# Altium project proto_main.PrjPcb
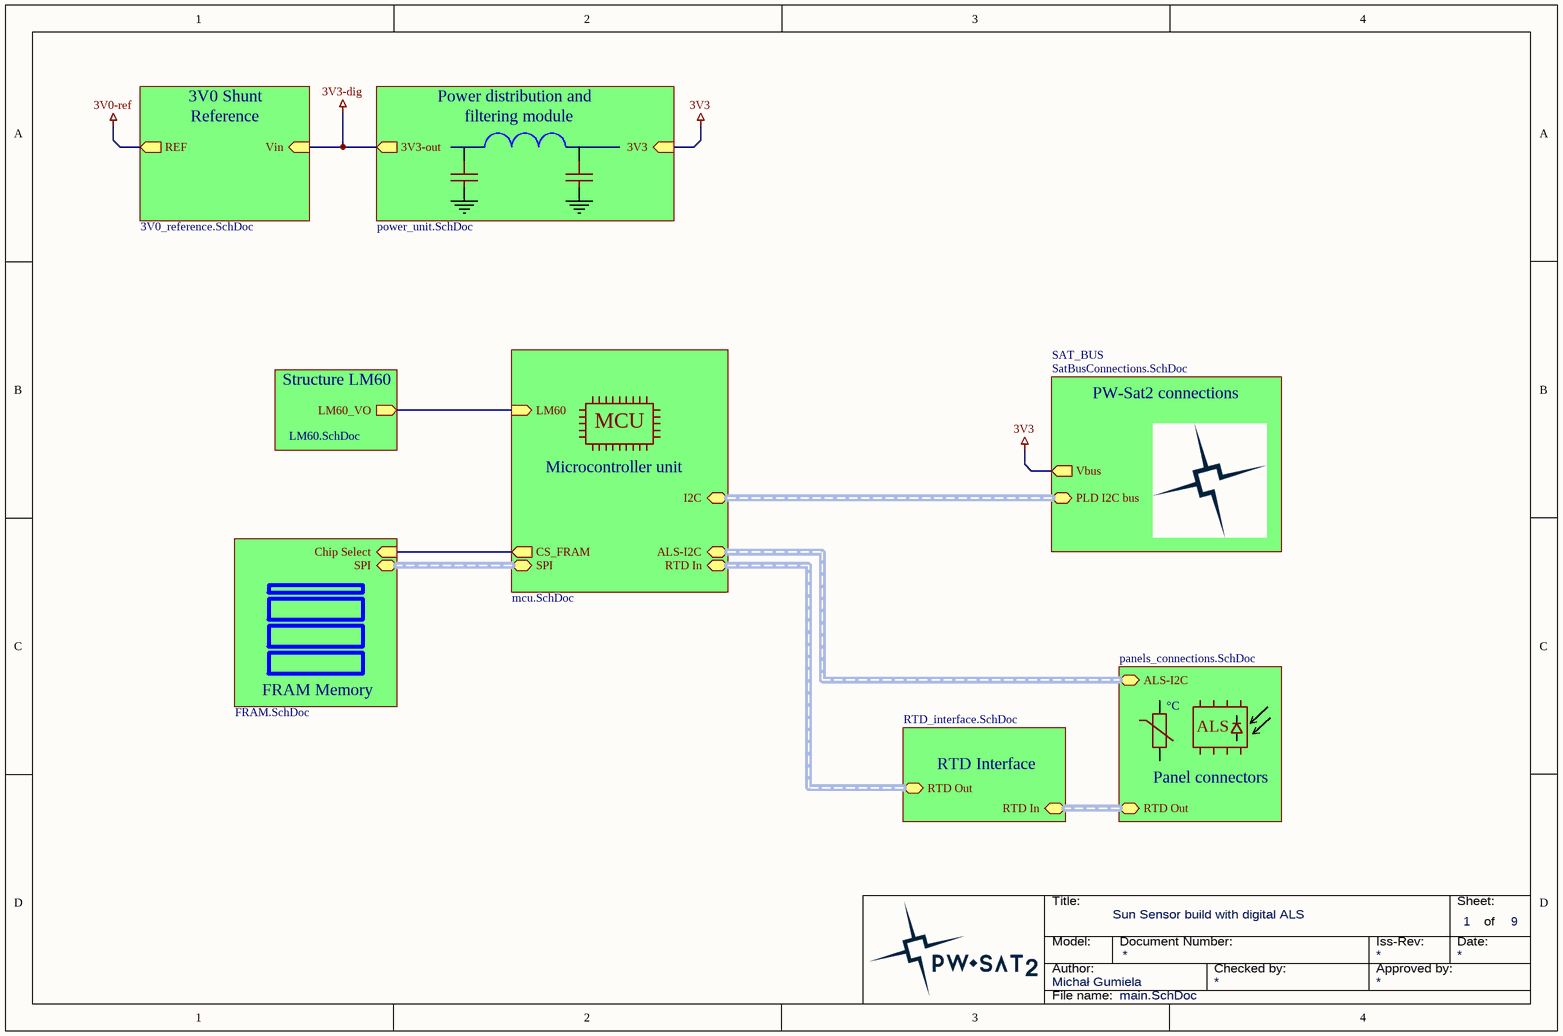
[diagram p0: main.SchDoc]
9 sheets, 83 parts. Net scope: hierarchical (ports join the sheet entries above them; power ports are global).
Board file: proto_main.PcbDoc
Sheets:
  main.SchDoc
    MCU = mcu.SchDoc
    POWER = power_unit.SchDoc
    FRAM = FRAM.SchDoc
    SAT_BUS = SatBusConnections.SchDoc
    PANELS_CONN = panels_connections.SchDoc
    RTD_Interface = RTD_interface.SchDoc
    3.0V Reference = 3V0_reference.SchDoc
    Structure LM60 = LM60.SchDoc

## Sheet main.SchDoc: Sun Sensor build with digital ALS
size A4; Author: Michał Gumiela; SheetNumber: 1; SheetTotal: 9; PageSetup: Record=PageOptions|CenterHorizontal=True|CenterVertical=True|PrintScale=1.00|XCorrection=1.00|YCorrection=1.00|PrintKind=0|BorderSize=5000000|LeftOffset=0|BottomOffset=0|Orientation=2|PaperLength=1000|PaperWidth=1000|Scale=100|PaperSource=7|PrintQuality=-3|MediaType=1|DitherType=10|PrintScaleMode=1|PaperKind=A4|PaperIndex=9

### Sub-sheets
3.0V Reference = 3V0_reference.SchDoc: Vin (in), REF (out)
FRAM = FRAM.SchDoc: SPI (harness SPI), Chip Select (in)
MCU = mcu.SchDoc: RTD In (harness RTD-DIV), ALS-I2C (harness SOFT-I2C), CS_FRAM (out), SPI (harness SPI), I2C (harness I2C), LM60 (in)
PANELS_CONN = panels_connections.SchDoc: ALS-I2C (harness SOFT-I2C), RTD Out (harness RTD-RAW)
POWER = power_unit.SchDoc: 3V3-out (out), 3V3 (in)
RTD_Interface = RTD_interface.SchDoc: RTD In (harness RTD-RAW), RTD Out (harness RTD-DIV)
SAT_BUS = SatBusConnections.SchDoc: PLD I2C bus (harness I2C), Vbus (out)
Structure LM60 = LM60.SchDoc: LM60_VO (out)

### Nets
3V3: sheet POWER/3V3, sheet SAT_BUS/Vbus
3V3-dig: sheet POWER/3V3-out, sheet 3.0V Reference/Vin
NetR18_1: sheet MCU/LM60, sheet Structure LM60/LM60_VO
NetR32_1: sheet MCU/CS_FRAM, sheet FRAM/Chip Select

### Buses and harness runs
harness sheet FRAM/SPI = sheet MCU/SPI
harness sheet MCU/ALS-I2C = sheet PANELS_CONN/ALS-I2C
harness sheet MCU/I2C = sheet SAT_BUS/PLD I2C bus
harness sheet MCU/RTD In = sheet RTD_Interface/RTD Out
harness sheet PANELS_CONN/RTD Out = sheet RTD_Interface/RTD In

### Notes on the sheet
- 3V0 Shunt
- Power distribution and
- Reference
- filtering module
- MCU
- PW-Sat2 connections
- Microcontroller unit
- FRAM Memory
- °C
- RTD Interface
- Panel connectors
- ALS
- Title:
- Sheet:
- of
- Author:
- Model:
- Document Number:
- Checked by:
- Iss-Rev:
- Approved by:
- Date:
- File name:

## Sheet mcu.SchDoc
size A2
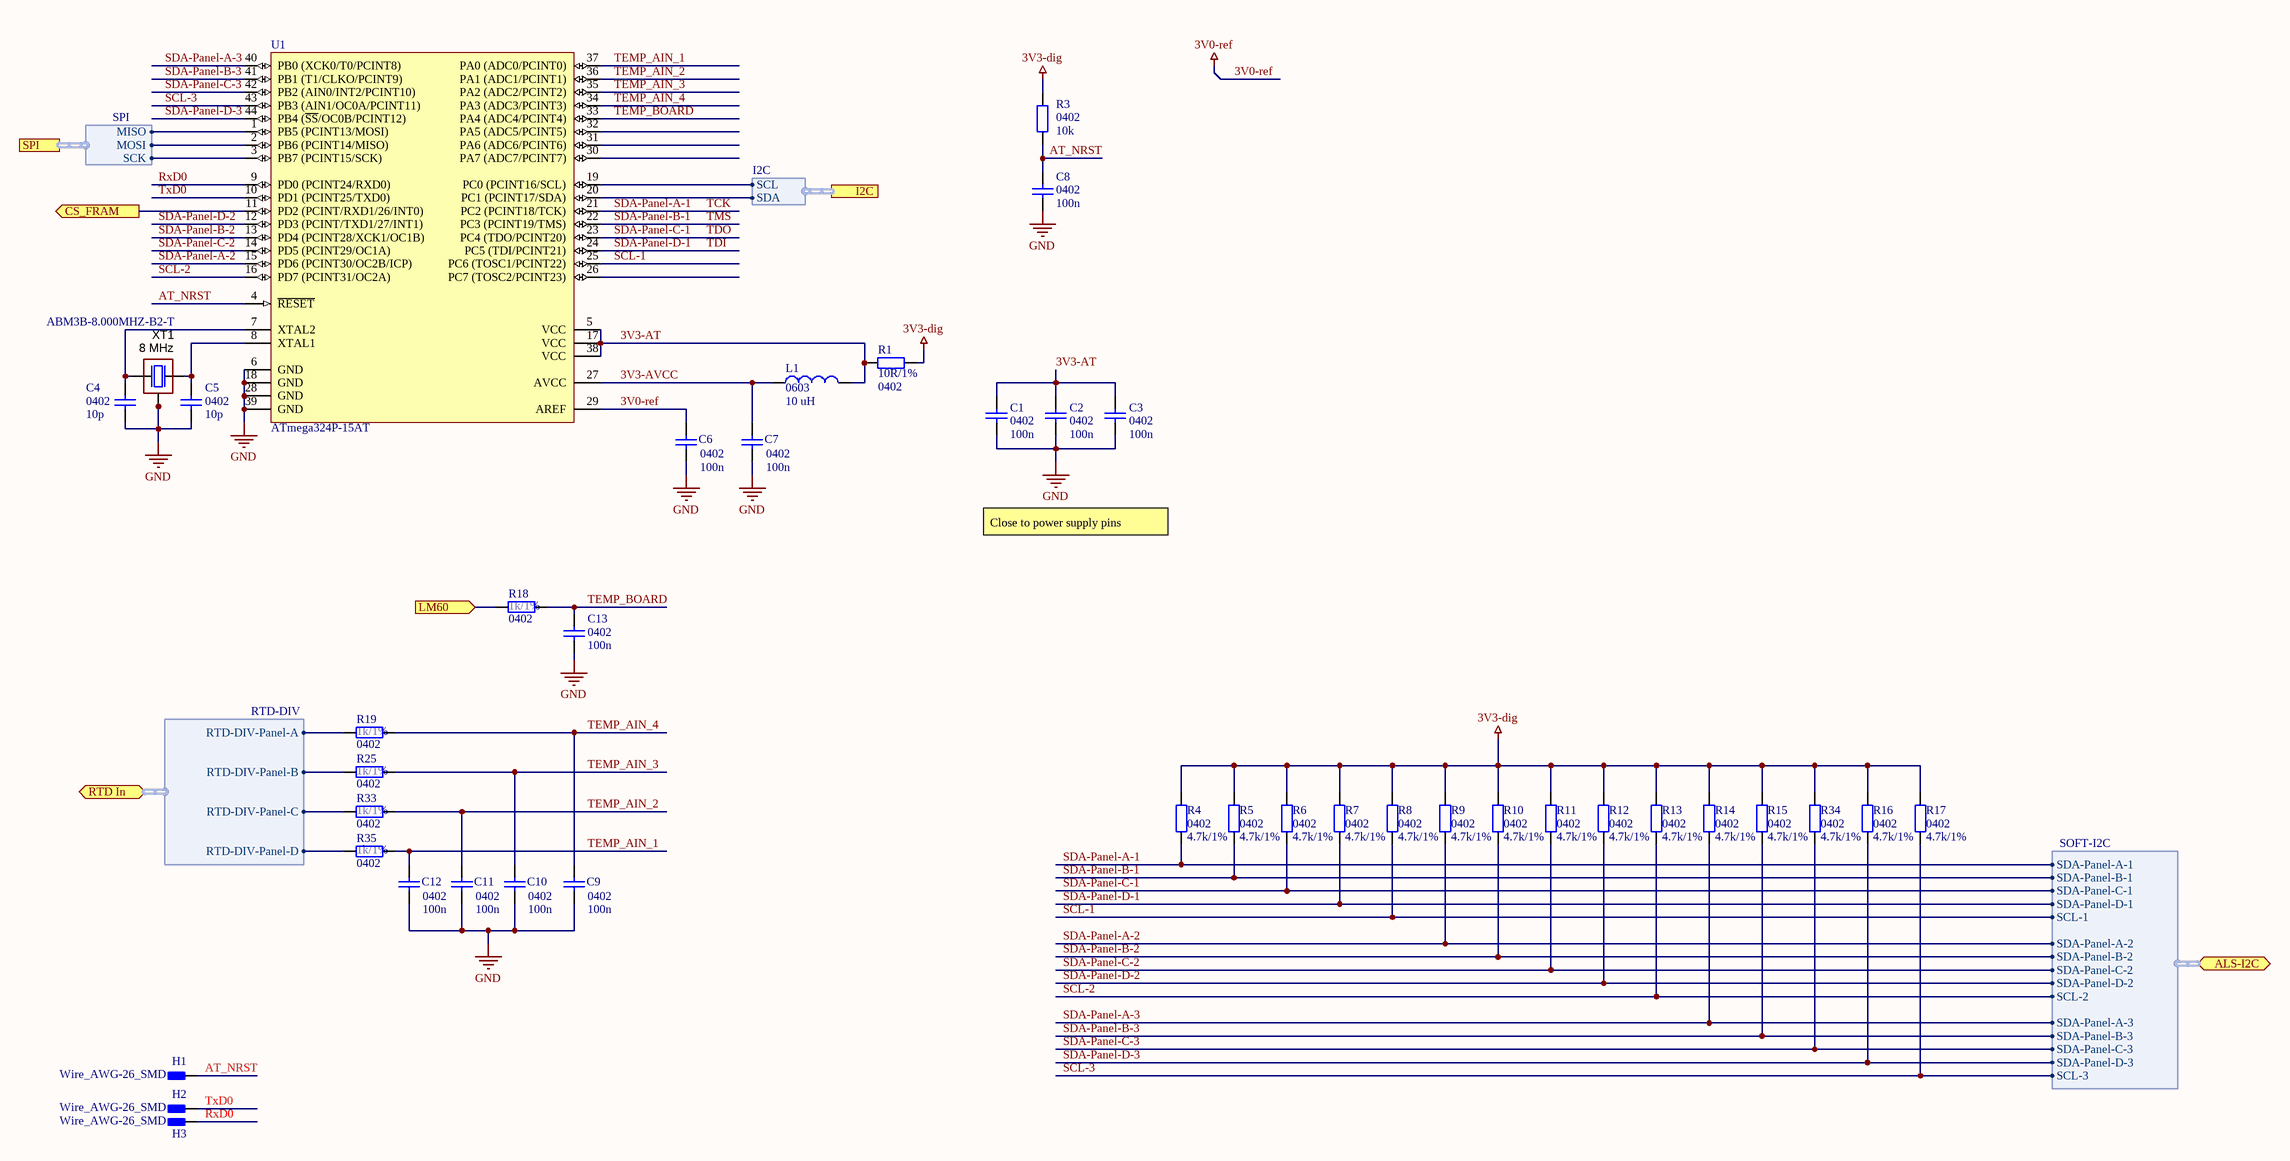
[diagram p1: mcu.SchDoc]

### Parts
C1  0402  value 100n  [SMD_Capacitor_0402]
C2  0402  value 100n  [SMD_Capacitor_0402]
C3  0402  value 100n  [SMD_Capacitor_0402]
C4  0402  value 10p  [SMD_Capacitor_0402]
C5  0402  value 10p  [SMD_Capacitor_0402]
C6  0402  value 100n  [SMD_Capacitor_0402]
C7  0402  value 100n  [SMD_Capacitor_0402]
C8  0402  value 100n  [SMD_Capacitor_0402]
C9  0402  value 100n  [SMD_Capacitor_0402]
C10  0402  value 100n  [SMD_Capacitor_0402]
C11  0402  value 100n  [SMD_Capacitor_0402]
C12  0402  value 100n  [SMD_Capacitor_0402]
C13  0402  value 100n  [SMD_Capacitor_0402]
H1  Wire_AWG-26_SMD  [Wire_AWG-26_SMD]
H2  Wire_AWG-26_SMD  [Wire_AWG-26_SMD]
H3  Wire_AWG-26_SMD  [Wire_AWG-26_SMD]
L1  10 uH  PackageReference: 0603  [SMD_Resistor_0603]
R1  Package: 0402  [SMD_Resistor_0402]  (hidden comment: 10R/1%)
R3  0402  value 10k  [SMD_Capacitor_0402]
R4  Package: 0402  [SMD_Resistor_0402]  (hidden comment: 4.7k/1%)
R5  Package: 0402  [SMD_Resistor_0402]  (hidden comment: 4.7k/1%)
R6  Package: 0402  [SMD_Resistor_0402]  (hidden comment: 4.7k/1%)
R7  Package: 0402  [SMD_Resistor_0402]  (hidden comment: 4.7k/1%)
R8  Package: 0402  [SMD_Resistor_0402]  (hidden comment: 4.7k/1%)
R9  Package: 0402  [SMD_Resistor_0402]  (hidden comment: 4.7k/1%)
R10  Package: 0402  [SMD_Resistor_0402]  (hidden comment: 4.7k/1%)
R11  Package: 0402  [SMD_Resistor_0402]  (hidden comment: 4.7k/1%)
R12  Package: 0402  [SMD_Resistor_0402]  (hidden comment: 4.7k/1%)
R13  Package: 0402  [SMD_Resistor_0402]  (hidden comment: 4.7k/1%)
R14  Package: 0402  [SMD_Resistor_0402]  (hidden comment: 4.7k/1%)
R15  Package: 0402  [SMD_Resistor_0402]  (hidden comment: 4.7k/1%)
R16  Package: 0402  [SMD_Resistor_0402]  (hidden comment: 4.7k/1%)
R17  Package: 0402  [SMD_Resistor_0402]  (hidden comment: 4.7k/1%)
R18  Package: 0402  [SMD_Resistor_0402]  (hidden comment: 1k/1%)
R19  Package: 0402  [SMD_Resistor_0402]  (hidden comment: 1k/1%)
R25  Package: 0402  [SMD_Resistor_0402]  (hidden comment: 1k/1%)
R33  Package: 0402  [SMD_Resistor_0402]  (hidden comment: 1k/1%)
R34  Package: 0402  [SMD_Resistor_0402]  (hidden comment: 4.7k/1%)
R35  Package: 0402  [SMD_Resistor_0402]  (hidden comment: 1k/1%)
U1  ATmega324P-15AT  [44ML_N]
XT1  8 MHz  [SMD, 5mm x 3.2mm]

### Ports
ALS-I2C (harness SOFT-I2C), CS_FRAM (out), I2C (harness I2C), LM60 (in), RTD In (harness RTD-DIV), SPI (harness SPI)

### Harnesses
SPI: MOSI, MISO, SCK
I2C: SCL, SDA
RTD-DIV: RTD-DIV-Panel-A, RTD-DIV-Panel-B, RTD-DIV-Panel-C, RTD-DIV-Panel-D
SOFT-I2C: SDA-Panel-A-1, SDA-Panel-D-1, SDA-Panel-B-1, SDA-Panel-C-1, SCL-1, SDA-Panel-A-2, SDA-Panel-D-2, SDA-Panel-B-2, SDA-Panel-C-2, SCL-2, SDA-Panel-A-3, SDA-Panel-D-3, SDA-Panel-B-3, SDA-Panel-C-3, SCL-3

### Nets
3V0-ref: C6.2 U1.29(AREF)
3V3-dig: R1.1 R3.2 R4.1 R5.1 R6.1 R7.1 R8.1 R9.1 R10.1 R11.1 R12.1 R13.1 R14.1 R15.1 R16.1 R17.1 R34.1
GND: C1.1 C2.1 C3.1 C4.1 C5.1 C6.1 C7.1 C8.1 C9.1 C10.1 C11.1 C12.1 C13.1 U1.6(GND) U1.18(GND) U1.28(GND) U1.39(GND) XT1.3(GND) XT1.4(GND)
3V3-AT: C1.2 C2.2 C3.2 L1.2 R1.2 U1.5(VCC) U1.17(VCC) U1.38(VCC)
3V3-AVCC: C7.2 L1.1 U1.27(AVCC)
AT_NRST: C8.2 H1.1 R3.1 U1.4(~{RESET})
RTD-Panel-A: R19.1 ; port RTD In.RTD-DIV-Panel-A
RTD-Panel-B: R25.1 ; port RTD In.RTD-DIV-Panel-B
RTD-Panel-C: R33.1 ; port RTD In.RTD-DIV-Panel-C
RTD-Panel-D: R35.1 ; port RTD In.RTD-DIV-Panel-D
RxD0: H3.1 U1.9(PD0_(PCINT24/RXD0))
SCL-1: R8.2 U1.25(PC6_(TOSC1/PCINT22)) ; port ALS-I2C.SCL-1
SCL-2: R13.2 U1.16(PD7_(PCINT31/OC2A)) ; port ALS-I2C.SCL-2
SCL-3: R17.2 U1.43(PB3_(AIN1/OC0A/PCINT11)) ; port ALS-I2C.SCL-3
SDA-Panel-A-1: R4.2 U1.21(PC2_(PCINT18/TCK)) ; port ALS-I2C.SDA-Panel-A-1  [also labelled TCK]
SDA-Panel-A-2: R9.2 U1.15(PD6_(PCINT30/OC2B/ICP)) ; port ALS-I2C.SDA-Panel-A-2
SDA-Panel-A-3: R14.2 U1.40(PB0_(XCK0/T0/PCINT8)) ; port ALS-I2C.SDA-Panel-A-3
SDA-Panel-B-1: R5.2 U1.22(PC3_(PCINT19/TMS)) ; port ALS-I2C.SDA-Panel-B-1  [also labelled TMS]
SDA-Panel-B-2: R10.2 U1.13(PD4_(PCINT28/XCK1/OC1B)) ; port ALS-I2C.SDA-Panel-B-2
SDA-Panel-B-3: R15.2 U1.41(PB1_(T1/CLKO/PCINT9)) ; port ALS-I2C.SDA-Panel-B-3
SDA-Panel-C-1: R6.2 U1.23(PC4_(TDO/PCINT20)) ; port ALS-I2C.SDA-Panel-C-1  [also labelled TDO]
SDA-Panel-C-2: R11.2 U1.14(PD5_(PCINT29/OC1A)) ; port ALS-I2C.SDA-Panel-C-2
SDA-Panel-C-3: R34.2 U1.42(PB2_(AIN0/INT2/PCINT10)) ; port ALS-I2C.SDA-Panel-C-3
SDA-Panel-D-1: R7.2 U1.24(PC5_(TDI/PCINT21)) ; port ALS-I2C.SDA-Panel-D-1  [also labelled TDI]
SDA-Panel-D-2: R12.2 U1.12(PD3_(PCINT/TXD1/27/INT1)) ; port ALS-I2C.SDA-Panel-D-2
SDA-Panel-D-3: R16.2 U1.44(PB4_(~{SS}/OC0B/PCINT12)) ; port ALS-I2C.SDA-Panel-D-3
TEMP_AIN_1: C12.2 R35.2 U1.37(PA0_(ADC0/PCINT0))
TEMP_AIN_2: C11.2 R33.2 U1.36(PA1_(ADC1/PCINT1))
TEMP_AIN_3: C10.2 R25.2 U1.35(PA2_(ADC2/PCINT2))
TEMP_AIN_4: C9.2 R19.2 U1.34(PA3_(ADC3/PCINT3))
TEMP_BOARD: C13.2 R18.2 U1.33(PA4_(ADC4/PCINT4))
TxD0: H2.1 U1.10(PD1_(PCINT25/TXD0))
NetC4_2: C4.2 U1.7(XTAL2) XT1.1(inp)
NetC5_2: C5.2 U1.8(XTAL1) XT1.2(out)
NetR2_1: U1.2(PB6_(PCINT14/MISO)) ; port SPI.MOSI
NetR18_1: R18.1 ; port LM60
NetR21_1: U1.3(PB7_(PCINT15/SCK)) ; port SPI.SCK
NetR24_1: U1.1(PB5_(PCINT13/MOSI)) ; port SPI.MISO
NetR32_1: U1.11(PD2_(PCINT/RXD1/26/INT0)) ; port CS_FRAM
NetR36_1: U1.19(PC0_(PCINT16/SCL)) ; port I2C.SCL
NetR37_1: U1.20(PC1_(PCINT17/SDA)) ; port I2C.SDA

Not connected (* = marked no-connect by the designer): U1 26(PC7_(TOSC2/PCINT23)) 30(PA7_(ADC7/PCINT7)) 31(PA6_(ADC6/PCINT6)) 32(PA5_(ADC5/PCINT5))

### Notes on the sheet
- Close to power supply pins
- Title:
- Sheet:
- of
- Author:
- Model:
- File name:
- Document Number:
- Checked by:
- Iss-Rev:
- Approved by:
- Date:

### Library data of the parts
C1-C3 C6-C13 = Cap: Capacitor; Published: 8-Jun-2000; LatestRevisionDate: 17-Jul-2002; LatestRevisionNote: Re-released for DXP Platform.; PackageReference: RAD-0.3; Publisher: Altium Limited; PackageDescription: Radial Cap, Thru-Hole; 2 Leads; 0.3 in Pin Spacing
C4 C5 = Cap1: Capacitor; Published: 8-Jun-2000; LatestRevisionDate: 17-Jul-2002; LatestRevisionNote: Re-released for DXP Platform.; PackageReference: RAD-0.3; Publisher: Altium Limited; PackageDescription: Radial Cap, Thru-Hole; 2 Leads; 0.3 in Pin Spacing
H1-H3 = Wire_AWG-26_SMD: SMD wire solder point.; Value: Wire_AWG-26_SMD
L1 = Inductor: Code_IEC: 1005; Published: 8-Jun-2000; LatestRevisionDate: 29-May-2009; LatestRevisionNote: IPC-7351 Footprint Added.; Publisher: Altium Limited; PackageDescription: Chip Inductor; Code_JEITA: 0402; Value: 10 uH
R1 = CRCW040210R0FKxxxx: 10R/1% Vishay CRCW 0402 Resistor. 63mW, 100ppm, 50V.; Manufacturer: Vishay; ManufacturerPartNumber: CRCW040210R0FKxxxx; Value: 10R/1%
R3 = Res2: Resistor; Published: 8-Jun-2000; LatestRevisionDate: 17-Jul-2002; LatestRevisionNote: Re-released for DXP Platform.; PackageReference: AXIAL-0.4; Publisher: Altium Limited; PackageDescription: Axial Device, Thru-Hole; 2 Leads; 0.4 in Pin Spacing
R4-R17 R34 = CRCW04024K70FKxxxx: 4.7k/1% Vishay CRCW 0402 Resistor. 63mW, 100ppm, 50V.; ManufacturerPartNumber: CRCW04024K70FKxxxx; Manufacturer: Vishay; Value: 4.7k/1%
R18 R19 R25 R33 R35 = CRCW04021K00FKxxxx: 1k/1% Vishay CRCW 0402 Resistor. 63mW, 100ppm, 50V.; Manufacturer: Vishay; ManufacturerPartNumber: CRCW04021K00FKxxxx; Value: 1k/1%
U1 = ATmega324P-15AT: 8-bit Automotive AVR Microcontroller, 32KB Flash, 1KB EEPROM, 2KB SRAM, Automotive Quality (-40°C to +85°C), 44-Pin TQFP; DatasheetVersion: revF, Sep-2009; PackageVersion: rev.G, Jul-2007; PackageReference: 44ML; PackageDescription: 44-Pin Plastic Thin Quad Flat Pack, 10 x 10 x 1.0 mm Body, 0.8 mm Pitch (TQFP); ComponentLink1Description: Manufacturer URL; ComponentLink1URL: http://www.atmel.com/; ComponentLink2Description: ATmega164P/324P/644P Datasheet; ComponentLink2URL: http://www.atmel.com/dyn/resources/prod_documents/doc7674.pdf; ComponentLink3Description: ATmega164P/324P/644P Summary; ComponentLink3URL: http://www.atmel.com/dyn/resources/prod_documents/7674S.pdf
XT1 = ABM3B-8.000MHZ-B2-T: Resonator Ceramic; value: 8 MHz; Manufacturer Part Number: ABM3B-8.000MHZ-B2-T

## Sheet power_unit.SchDoc
size A4
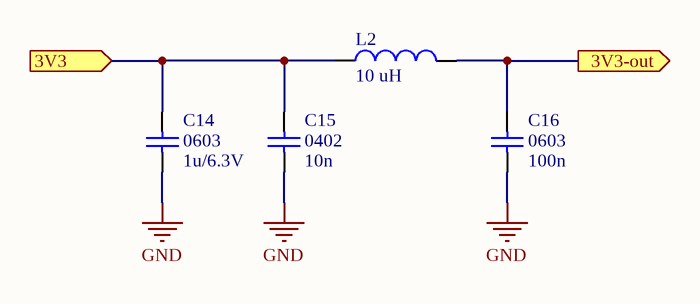
[diagram p2: power_unit.SchDoc]

### Parts
C14  0603  value 1u/6.3V  [SMD_Capacitor_0603]
C15  0402  value 10n  [SMD_Capacitor_0402]
C16  0603  value 100n  [SMD_Capacitor_0603]
L2  10 uH  [SMD_Resistor_0603]

### Ports
3V3 (in), 3V3-out (out)

### Nets
3V3: C14.2 C15.2 L2.1 ; port 3V3
3V3-dig: C16.2 L2.2 ; port 3V3-out
GND: C14.1 C15.1 C16.1

### Notes on the sheet
- Title:
- Sheet:
- of
- Author:
- Model:
- Document Number:
- Checked by:
- Iss-Rev:
- Approved by:
- Date:
- File name:

### Library data of the parts
C14-C16 = Cap: Capacitor; Published: 8-Jun-2000; LatestRevisionDate: 17-Jul-2002; LatestRevisionNote: Re-released for DXP Platform.; PackageReference: RAD-0.3; Publisher: Altium Limited; PackageDescription: Radial Cap, Thru-Hole; 2 Leads; 0.3 in Pin Spacing
L2 = Inductor: Code_IEC: 1005; Published: 8-Jun-2000; LatestRevisionDate: 29-May-2009; LatestRevisionNote: IPC-7351 Footprint Added.; PackageReference: 0402-A; Publisher: Altium Limited; PackageDescription: Chip Inductor; Code_JEITA: 0402

## Sheet FRAM.SchDoc: FRAM Memory
size A4; DocumentNumber: 15; SheetNumber: 15; SheetTotal: 16; Model: EM1; PageSetup: Record=PageOptions|CenterHorizontal=True|CenterVertical=True|PrintScale=0.52|XCorrection=1.00|YCorrection=1.00|PrintKind=1|BorderSize=5000000|LeftOffset=0|BottomOffset=0|Orientation=2|PaperLength=4200|PaperWidth=2970|Scale=100|PaperSource=7|PrintQuality=600|MediaType=1|DitherType=10|PaperKind=A3|PrintScaleMode=1
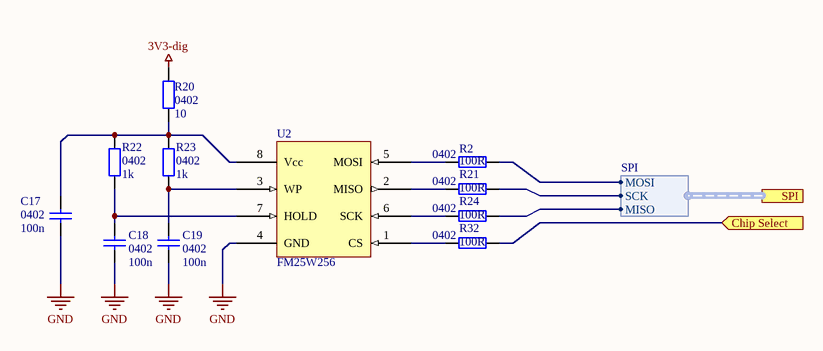
[diagram p3: FRAM.SchDoc]

### Parts
C17  0402  value 100n  [SMD_Capacitor_0402]
C18  0402  value 100n  [SMD_Capacitor_0402]
C19  0402  value 100n  [SMD_Capacitor_0402]
R2  0402  value 100R  [SMD_Resistor_0402]
R20  0402  value 10  [SMD_Resistor_0402]
R21  0402  value 100R  [SMD_Resistor_0402]
R22  0402  value 1k  [SMD_Resistor_0402]
R23  0402  value 1k  [SMD_Resistor_0402]
R24  0402  value 100R  [SMD_Resistor_0402]
R32  0402  value 100R  [SMD_Resistor_0402]
U2  FM25W256  [SOIC-8-N]

### Ports
Chip Select (in), SPI (harness SPI)

### Harnesses
SPI: MOSI, MISO, SCK

### Nets
3V3-dig: R20.2
GND: C17.2 C18.2 C19.2 U2.4(GND)
NetC17_1: C17.1 R20.1 R22.2 R23.2 U2.8(Vcc)
NetC18_1: C18.1 R22.1 U2.7(HOLD)
NetC19_1: C19.1 R23.1 U2.3(WP)
NetR2_1: R2.1 ; port SPI.MOSI
NetR2_2: R2.2 U2.5(MOSI)
NetR21_1: R21.1 ; port SPI.SCK
NetR21_2: R21.2 U2.2(MISO)
NetR24_1: R24.1 ; port SPI.MISO
NetR24_2: R24.2 U2.6(SCK)
NetR32_1: R32.1 ; port Chip Select
NetR32_2: R32.2 U2.1(CS)

### Notes on the sheet
- Title:
- Sheet:
- of
- Author:
- Model:
- Document Number:
- Checked by:
- Iss-Rev:
- Approved by:
- Date:
- File name:

### Library data of the parts
C17-C19 = Cap1: Capacitor; Published: 8-Jun-2000; LatestRevisionDate: 17-Jul-2002; LatestRevisionNote: Re-released for DXP Platform.; PackageReference: RAD-0.3; Publisher: Altium Limited; PackageDescription: Radial Cap, Thru-Hole; 2 Leads; 0.3 in Pin Spacing
R2 R20-R24 R32 = Res2: Resistor; Published: 8-Jun-2000; LatestRevisionDate: 17-Jul-2002; LatestRevisionNote: Re-released for DXP Platform.; PackageReference: AXIAL-0.4; Publisher: Altium Limited; PackageDescription: Axial Device, Thru-Hole; 2 Leads; 0.4 in Pin Spacing
U2 = FM25W256: 256Kb (8k x 32) SPI F-RAM

## Sheet SatBusConnections.SchDoc: SunS - PW-Sat2 connections
size A4; Author: Michał Gumiela; DocumentNumber: 16; SheetNumber: 16; SheetTotal: 16; Model: EM1; PageSetup: Record=PageOptions|CenterHorizontal=True|CenterVertical=True|PrintScale=0.52|XCorrection=1.00|YCorrection=1.00|PrintKind=1|BorderSize=5000000|LeftOffset=0|BottomOffset=0|Orientation=2|PaperLength=4200|PaperWidth=2970|Scale=100|PaperSource=7|PrintQuality=600|MediaType=1|DitherType=10|PaperKind=A3|PrintScaleMode=1
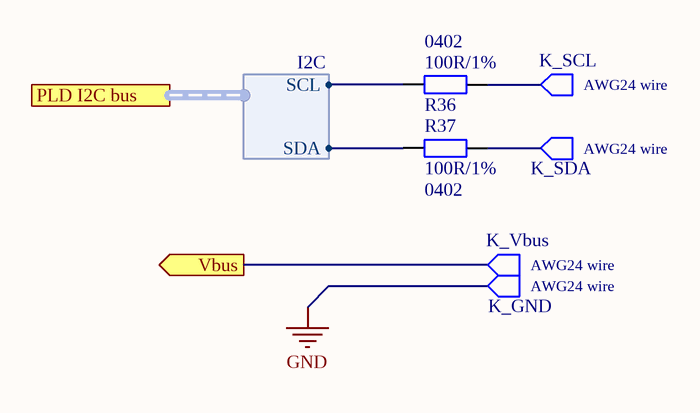
[diagram p4: SatBusConnections.SchDoc]

### Parts
K_GND  AWG24 wire  [wire-awg26-1_stress-relief]
K_SCL  AWG24 wire  [wire-awg26-1_stress-relief]
K_SDA  AWG24 wire  [wire-awg26-1_stress-relief]
K_Vbus  AWG24 wire  [wire-awg26-1_stress-relief]
R36  Package: 0402  [SMD_Resistor_0402]  (hidden comment: 100R/1%)
R37  Package: 0402  [SMD_Resistor_0402]  (hidden comment: 100R/1%)

### Ports
PLD I2C bus (harness I2C), Vbus (out)

### Harnesses
I2C: SCL, SDA

### Nets
3V3: K_Vbus.1 ; port Vbus
GND: K_GND.1
NetK_SCL_1: K_SCL.1 R36.2
NetK_SDA_1: K_SDA.1 R37.2
NetR36_1: R36.1 ; port PLD I2C bus.SCL
NetR37_1: R37.1 ; port PLD I2C bus.SDA

### Notes on the sheet
- Title:
- Sheet:
- of
- Author:
- Model:
- Document Number:
- Checked by:
- Iss-Rev:
- Approved by:
- Date:
- File name:

### Library data of the parts
K_GND K_SCL K_SDA K_Vbus = wire-awg26-1: Single wire AWG26 solder point.; Value: AWG24 wire
R36 R37 = CRCW0402100RFKxxxx: 100R/1% Vishay CRCW 0402 Resistor. 63mW, 100ppm, 50V.; Manufacturer: Vishay; ManufacturerPartNumber: CRCW0402100RFKxxxx; Value: 100R/1%

## Sheet panels_connections.SchDoc: Panel connectors
size A4; Author: Michał Gumiela
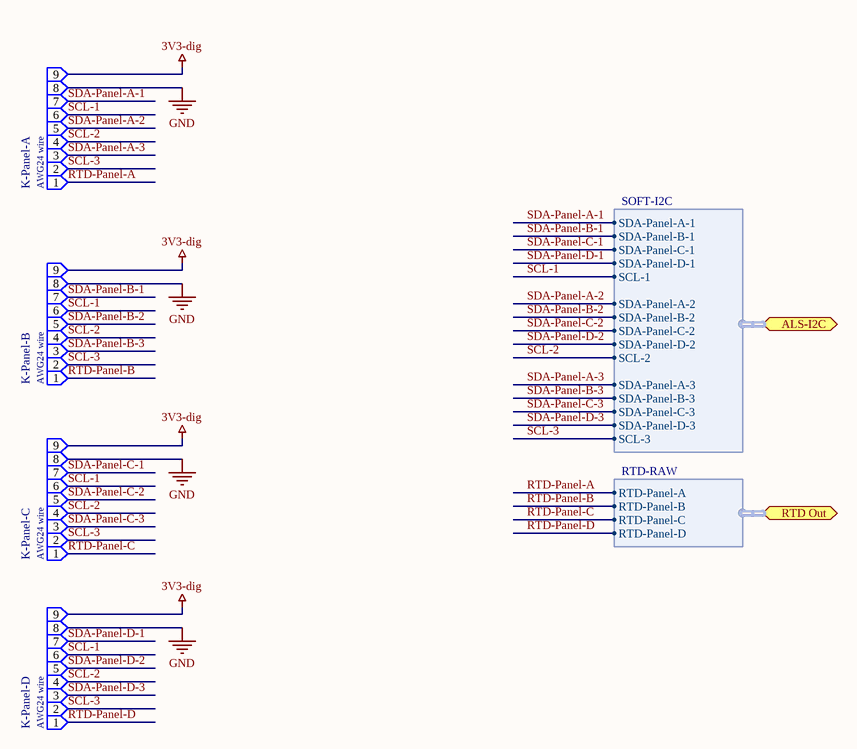
[diagram p5: panels_connections.SchDoc]

### Parts
K-Panel-A  AWG24 wire  [wire-awg26-9_stress-relief]
K-Panel-B  AWG24 wire  [wire-awg26-9_stress-relief]
K-Panel-C  AWG24 wire  [wire-awg26-9_stress-relief]
K-Panel-D  AWG24 wire  [wire-awg26-9_stress-relief]

### Ports
ALS-I2C (harness SOFT-I2C), RTD Out (harness RTD-RAW)

### Harnesses
SOFT-I2C: SDA-Panel-A-1, SDA-Panel-D-1, SDA-Panel-B-1, SDA-Panel-C-1, SCL-1, SDA-Panel-A-2, SDA-Panel-D-2, SDA-Panel-B-2, SDA-Panel-C-2, SCL-2, SDA-Panel-A-3, SDA-Panel-D-3, SDA-Panel-B-3, SDA-Panel-C-3, SCL-3
RTD-RAW: RTD-Panel-A, RTD-Panel-B, RTD-Panel-C, RTD-Panel-D

### Nets
3V3-dig: K-Panel-A.9 K-Panel-B.9 K-Panel-C.9 K-Panel-D.9
GND: K-Panel-A.8 K-Panel-B.8 K-Panel-C.8 K-Panel-D.8
RTD-Panel-A: K-Panel-A.1 ; port RTD Out.RTD-Panel-A
RTD-Panel-B: K-Panel-B.1 ; port RTD Out.RTD-Panel-B
RTD-Panel-C: K-Panel-C.1 ; port RTD Out.RTD-Panel-C
RTD-Panel-D: K-Panel-D.1 ; port RTD Out.RTD-Panel-D
SCL-1: K-Panel-A.6 K-Panel-B.6 K-Panel-C.6 K-Panel-D.6 ; port ALS-I2C.SCL-1
SCL-2: K-Panel-A.4 K-Panel-B.4 K-Panel-C.4 K-Panel-D.4 ; port ALS-I2C.SCL-2
SCL-3: K-Panel-A.2 K-Panel-B.2 K-Panel-C.2 K-Panel-D.2 ; port ALS-I2C.SCL-3
SDA-Panel-A-1: K-Panel-A.7 ; port ALS-I2C.SDA-Panel-A-1
SDA-Panel-A-2: K-Panel-A.5 ; port ALS-I2C.SDA-Panel-A-2
SDA-Panel-A-3: K-Panel-A.3 ; port ALS-I2C.SDA-Panel-A-3
SDA-Panel-B-1: K-Panel-B.7 ; port ALS-I2C.SDA-Panel-B-1
SDA-Panel-B-2: K-Panel-B.5 ; port ALS-I2C.SDA-Panel-B-2
SDA-Panel-B-3: K-Panel-B.3 ; port ALS-I2C.SDA-Panel-B-3
SDA-Panel-C-1: K-Panel-C.7 ; port ALS-I2C.SDA-Panel-C-1
SDA-Panel-C-2: K-Panel-C.5 ; port ALS-I2C.SDA-Panel-C-2
SDA-Panel-C-3: K-Panel-C.3 ; port ALS-I2C.SDA-Panel-C-3
SDA-Panel-D-1: K-Panel-D.7 ; port ALS-I2C.SDA-Panel-D-1
SDA-Panel-D-2: K-Panel-D.5 ; port ALS-I2C.SDA-Panel-D-2
SDA-Panel-D-3: K-Panel-D.3 ; port ALS-I2C.SDA-Panel-D-3

### Notes on the sheet
- Title:
- Sheet:
- of
- Author:
- Model:
- Document Number:
- Checked by:
- Iss-Rev:
- Approved by:
- Date:
- File name:

### Library data of the parts
K-Panel-A K-Panel-B K-Panel-C K-Panel-D = wire-awg26-9: Single wire AWG26 solder point.; Value: AWG24 wire

## Sheet RTD_interface.SchDoc: RTD Interface
size A4
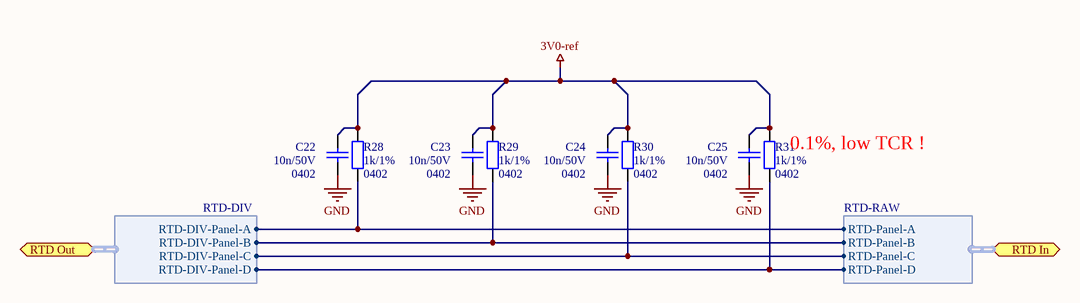
[diagram p6: RTD_interface.SchDoc]

### Parts
C22  Package: 0402  [SMD_Capacitor_0402]  (hidden comment: 10n/50V)
C23  Package: 0402  [SMD_Capacitor_0402]  (hidden comment: 10n/50V)
C24  Package: 0402  [SMD_Capacitor_0402]  (hidden comment: 10n/50V)
C25  Package: 0402  [SMD_Capacitor_0402]  (hidden comment: 10n/50V)
R28  Package: 0402  [SMD_Resistor_0402]  (hidden comment: 1k/1%)
R29  Package: 0402  [SMD_Resistor_0402]  (hidden comment: 1k/1%)
R30  Package: 0402  [SMD_Resistor_0402]  (hidden comment: 1k/1%)
R31  Package: 0402  [SMD_Resistor_0402]  (hidden comment: 1k/1%)

### Ports
RTD In (harness RTD-RAW), RTD Out (harness RTD-DIV)

### Harnesses
RTD-RAW: RTD-Panel-A, RTD-Panel-B, RTD-Panel-C, RTD-Panel-D
RTD-DIV: RTD-DIV-Panel-A, RTD-DIV-Panel-B, RTD-DIV-Panel-C, RTD-DIV-Panel-D

### Nets
3V0-ref: C22.1 C23.1 C24.1 C25.1 R28.1 R29.1 R30.1 R31.1
GND: C22.2 C23.2 C24.2 C25.2
RTD-Panel-A: R28.2 ; port RTD In.RTD-Panel-A, port RTD Out.RTD-DIV-Panel-A
RTD-Panel-B: R29.2 ; port RTD In.RTD-Panel-B, port RTD Out.RTD-DIV-Panel-B
RTD-Panel-C: R30.2 ; port RTD In.RTD-Panel-C, port RTD Out.RTD-DIV-Panel-C
RTD-Panel-D: R31.2 ; port RTD In.RTD-Panel-D, port RTD Out.RTD-DIV-Panel-D

### Notes on the sheet
- (near R31) 0.1%, low TCR !
- Title:
- Sheet:
- of
- Author:
- Model:
- Document Number:
- Checked by:
- Iss-Rev:
- Approved by:
- Date:
- File name:

### Library data of the parts
C22-C25 = Cer_C0402T103K5RALTU: Ceramic Cap Kemet COTS 10n/50V X7R 0402; ManufacturerPartNumber: C0402T103K5RALTU; Manufacturer: Kemet; Value: 10n/50V
R28-R31 = CRCW04021K00FKxxxx: as R18 on sheet mcu; Manufacturer: Vishay; ManufacturerPartNumber: CRCW04021K00FKxxxx; Value: 1k/1%

## Sheet 3V0_reference.SchDoc: 3.0V Reference
size A4
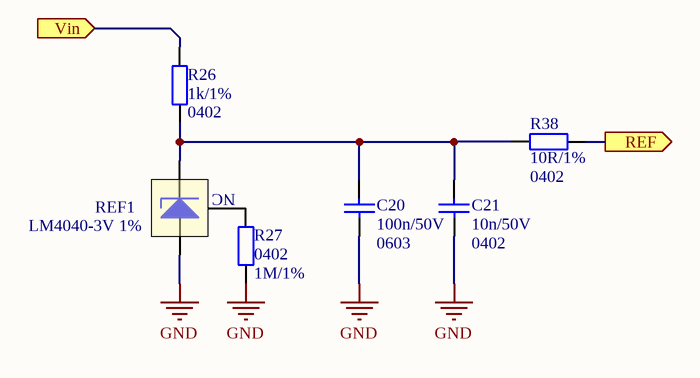
[diagram p7: 3V0_reference.SchDoc]

### Parts
C20  Package: 0603  [SMD_Capacitor_0603]  (hidden comment: 100n/50V)
C21  Package: 0402  [SMD_Capacitor_0402]  (hidden comment: 10n/50V)
R26  Package: 0402  [SMD_Resistor_0402]  (hidden comment: 1k/1%)
R27  Package: 0402  [SMD_Resistor_0402]  (hidden comment: 1M/1%)
R38  Package: 0402  [SMD_Resistor_0402]  (hidden comment: 10R/1%)
REF1  LM4040-3V 1%  [SOT23-3]

### Ports
REF (out), Vin (in)

### Nets
3V0-ref: R38.2 ; port REF
3V3-dig: R26.1 ; port Vin
GND: C20.2 C21.2 R27.2 REF1.2(A)
NetC20_1: C20.1 C21.1 R26.2 R38.1 REF1.1(K)
NetR27_1: R27.1 REF1.3(NC)

### Notes on the sheet
- Title:
- Sheet:
- of
- Author:
- Model:
- Document Number:
- Checked by:
- Iss-Rev:
- Approved by:
- Date:
- File name:

### Library data of the parts
C20 = Cer_C0603T104K5RALTU: Ceramic Cap Kemet COTS 100n/50V X7R 0603; Manufacturer: Kemet; ManufacturerPartNumber: C0603T104K5RALTU; Value: 100n/50V
C21 = Cer_C0402T103K5RALTU: Ceramic Cap Kemet COTS 10n/50V X7R 0402; ManufacturerPartNumber: C0402T103K5RALTU; Manufacturer: Kemet; Value: 10n/50V
R26 = CRCW04021K00FKxxxx: as R18 on sheet mcu; Manufacturer: Vishay; ManufacturerPartNumber: CRCW04021K00FKxxxx; Value: 1k/1%
R27 = CRCW04021M00FKxxxx: 1M/1% Vishay CRCW 0402 Resistor. 63mW, 100ppm, 50V.; Manufacturer: Vishay; ManufacturerPartNumber: CRCW04021M00FKxxxx; Value: 1M/1%
R38 = CRCW040210R0FKxxxx: as R1 on sheet mcu; Manufacturer: Vishay; ManufacturerPartNumber: CRCW040210R0FKxxxx; Value: 10R/1%
REF1 = LM4040DIM3-3.0: Shunt V-REF, 3V, 1%, SOT23-3; Manufacturer: Texas Instruments; ManufacturerPartNumber: LM4040DIM3-3.0; Value: LM4040-3V 1%

## Sheet LM60.SchDoc: LM60
size A4; CheckedBy: (not checked); Author: P. Kuligowski
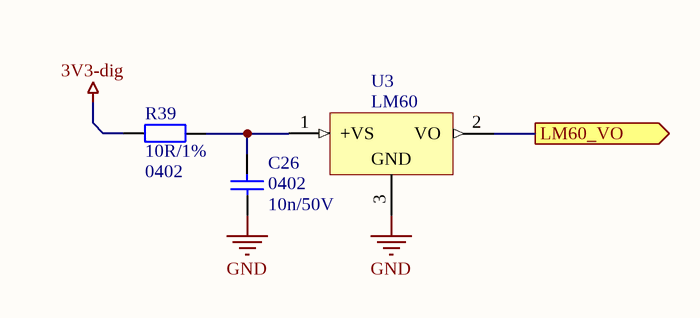
[diagram p8: LM60.SchDoc]

### Parts
C26  Package: 0402  [SMD_Capacitor_0402]  (hidden comment: 10n/50V)
R39  Package: 0402  [SMD_Resistor_0402]  (hidden comment: 10R/1%)
U3  LM60  [SOT23-3]

### Ports
LM60_VO (out)

### Nets
3V3-dig: R39.1
GND: C26.2 U3.3(GND)
NetC26_1: C26.1 R39.2 U3.1(+VS)
NetR18_1: U3.2(VO) ; port LM60_VO

### Notes on the sheet
- Title:
- Project:
- Author:
- Model:
- Document Number:
- Checked by:
- Rev:
- Date:
- Approved by:
- Sheet:
- of
- File name:

### Library data of the parts
C26 = Cer_GCM155R71H103KA55D: Ceramic Cap Murata Automotive 10n/50V X7R 0402; Manufacturer: Murata; ManufacturerPartNumber: GCM155R71H103KA55D; Value: 10n/50V
R39 = CRCW040210R0FKxxxx: as R1 on sheet mcu; Manufacturer: Vishay; ManufacturerPartNumber: CRCW040210R0FKxxxx; Value: 10R/1%
U3 = LM60: Analog temperature sensor

## Nets that join several sheets
3V0-ref: mcu (C6.2 U1.29), RTD_interface (8 pins), 3V0_reference (R38.2)
3V3: power_unit (C14.2 C15.2 L2.1), SatBusConnections (K_Vbus.1)
3V3-dig: mcu (17 pins), power_unit (C16.2 L2.2), FRAM (R20.2), panels_connections (K-Panel-A.9 K-Panel-B.9 K-Panel-C.9 K-Panel-D.9), 3V0_reference (R26.1), LM60 (R39.1)
GND: mcu (19 pins), power_unit (C14.1 C15.1 C16.1), FRAM (C17.2 C18.2 C19.2 U2.4), SatBusConnections (K_GND.1), panels_connections (K-Panel-A.8 K-Panel-B.8 K-Panel-C.8 K-Panel-D.8), RTD_interface (C22.2 C23.2 C24.2 C25.2), 3V0_reference (C20.2 C21.2 R27.2 REF1.2), LM60 (C26.2 U3.3)
NetR2_1: mcu (U1.2), FRAM (R2.1)
NetR18_1: mcu (R18.1), LM60 (U3.2)
NetR21_1: mcu (U1.3), FRAM (R21.1)
NetR24_1: mcu (U1.1), FRAM (R24.1)
NetR32_1: mcu (U1.11), FRAM (R32.1)
NetR36_1: mcu (U1.19), SatBusConnections (R36.1)
NetR37_1: mcu (U1.20), SatBusConnections (R37.1)
RTD-Panel-A: mcu (R19.1), panels_connections (K-Panel-A.1), RTD_interface (R28.2)
RTD-Panel-B: mcu (R25.1), panels_connections (K-Panel-B.1), RTD_interface (R29.2)
RTD-Panel-C: mcu (R33.1), panels_connections (K-Panel-C.1), RTD_interface (R30.2)
RTD-Panel-D: mcu (R35.1), panels_connections (K-Panel-D.1), RTD_interface (R31.2)
SCL-1: mcu (R8.2 U1.25), panels_connections (K-Panel-A.6 K-Panel-B.6 K-Panel-C.6 K-Panel-D.6)
SCL-2: mcu (R13.2 U1.16), panels_connections (K-Panel-A.4 K-Panel-B.4 K-Panel-C.4 K-Panel-D.4)
SCL-3: mcu (R17.2 U1.43), panels_connections (K-Panel-A.2 K-Panel-B.2 K-Panel-C.2 K-Panel-D.2)
SDA-Panel-A-1: mcu (R4.2 U1.21), panels_connections (K-Panel-A.7)
SDA-Panel-A-2: mcu (R9.2 U1.15), panels_connections (K-Panel-A.5)
SDA-Panel-A-3: mcu (R14.2 U1.40), panels_connections (K-Panel-A.3)
SDA-Panel-B-1: mcu (R5.2 U1.22), panels_connections (K-Panel-B.7)
SDA-Panel-B-2: mcu (R10.2 U1.13), panels_connections (K-Panel-B.5)
SDA-Panel-B-3: mcu (R15.2 U1.41), panels_connections (K-Panel-B.3)
SDA-Panel-C-1: mcu (R6.2 U1.23), panels_connections (K-Panel-C.7)
SDA-Panel-C-2: mcu (R11.2 U1.14), panels_connections (K-Panel-C.5)
SDA-Panel-C-3: mcu (R34.2 U1.42), panels_connections (K-Panel-C.3)
SDA-Panel-D-1: mcu (R7.2 U1.24), panels_connections (K-Panel-D.7)
SDA-Panel-D-2: mcu (R12.2 U1.12), panels_connections (K-Panel-D.5)
SDA-Panel-D-3: mcu (R16.2 U1.44), panels_connections (K-Panel-D.3)